# EAGLE design M81_1_0 (EAGLE 8.3.2)
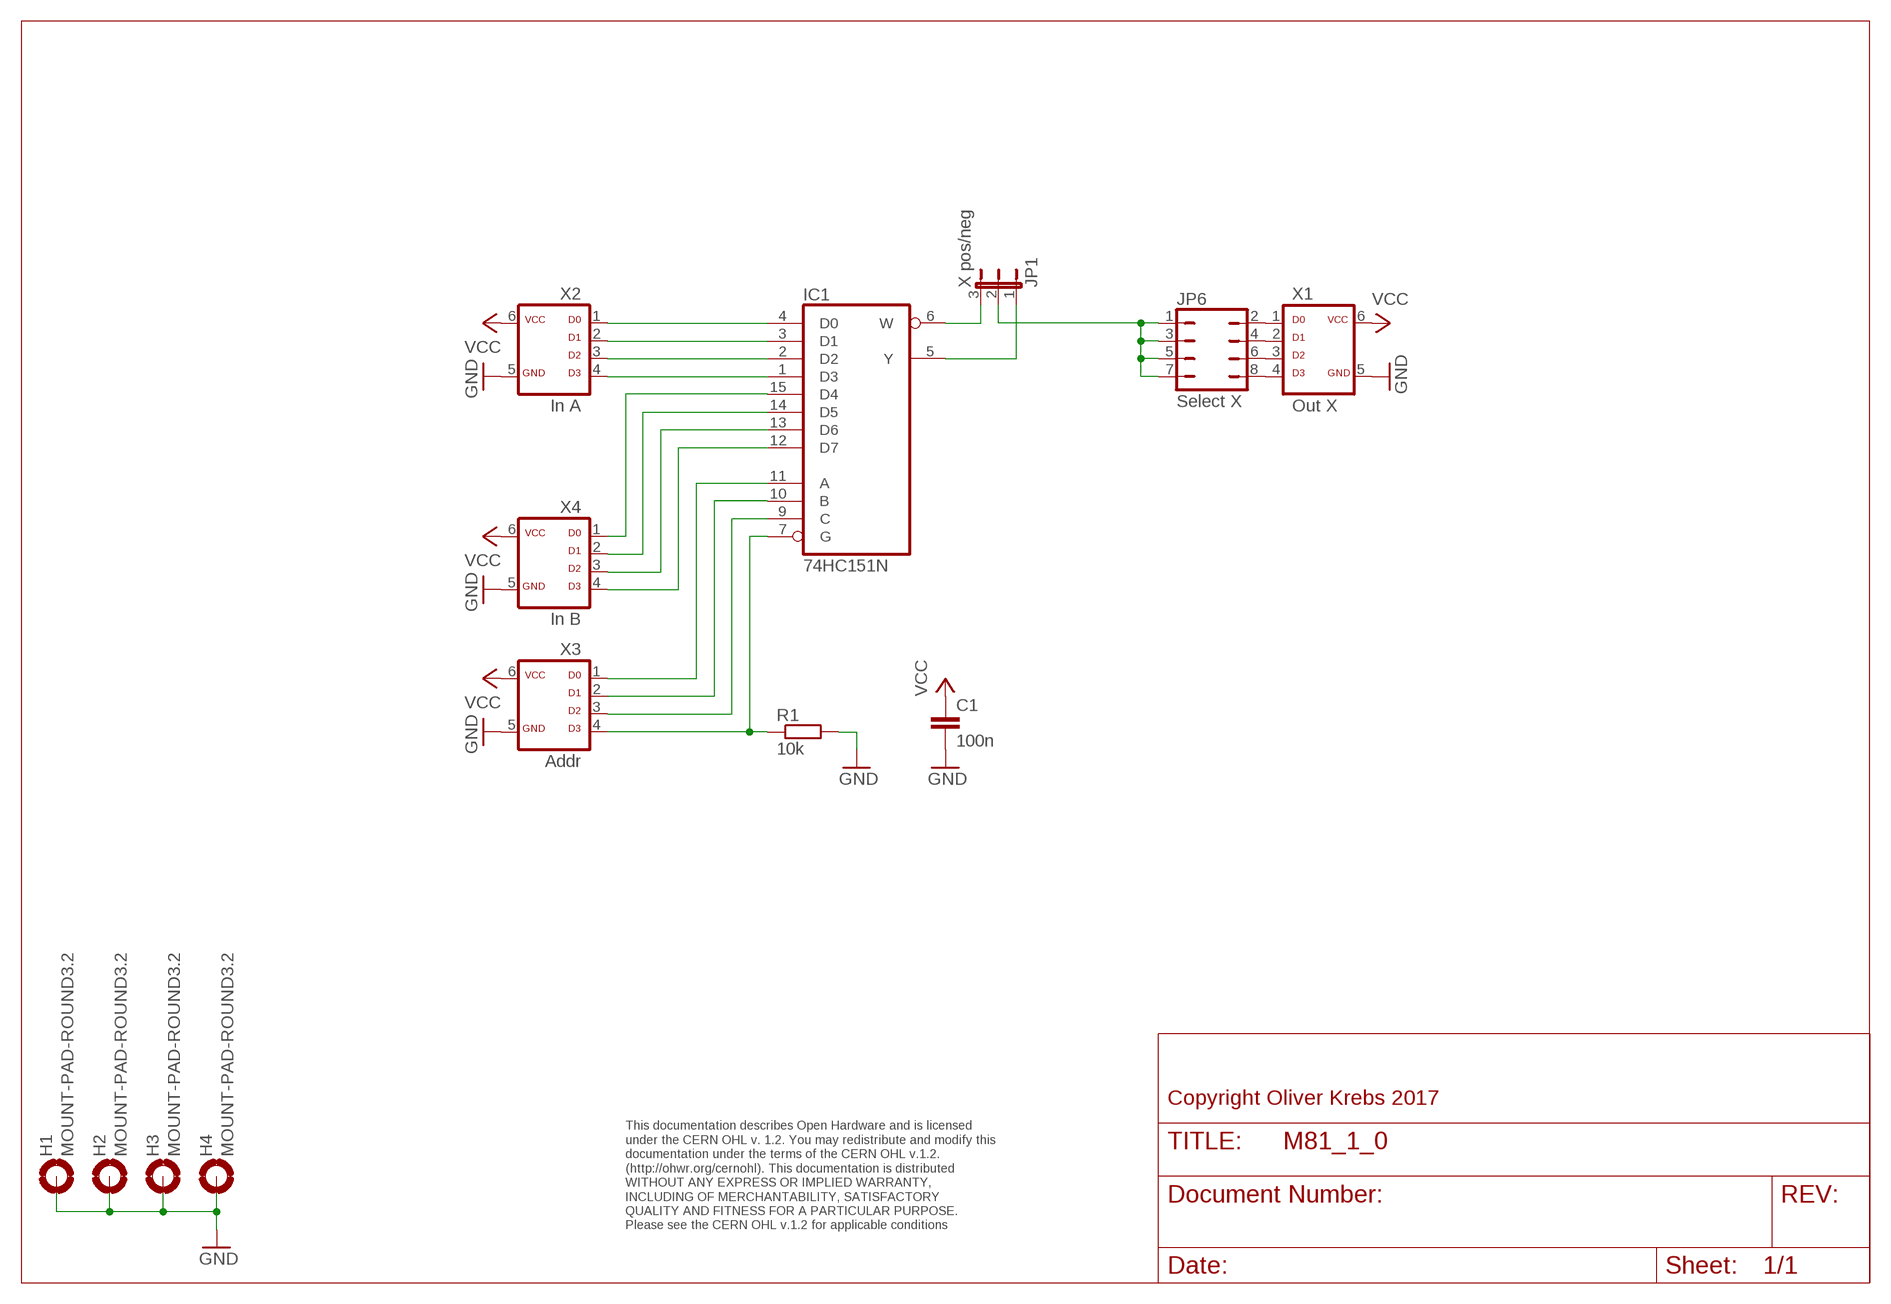
[diagram p0: schematic, sheet 1]

## Parts
C1  100n  C-EU050-025X075  [C050-025X075]
H1  MOUNT-PAD-ROUND3.2  [3,2-PAD]
H2  MOUNT-PAD-ROUND3.2  [3,2-PAD]
H3  MOUNT-PAD-ROUND3.2  [3,2-PAD]
H4  MOUNT-PAD-ROUND3.2  [3,2-PAD]
IC1  74HC151N  [DIL16]
JP1  X pos/neg  JP2E  [JP2]
JP6  Select X  JP4Q  [JP4Q]
R1  10k  R-EU_0207/10  [0207/10]
X1  Out X  ML6D  [ML-6]
X2  In A  ML6D  [ML-6]
X3  Addr  ML6D  [ML-6]
X4  In B  ML6D  [ML-6]

## Nets
GND: C1.2 H1.B3,2(MOUNT) H2.B3,2(MOUNT) H3.B3,2(MOUNT) H4.B3,2(MOUNT) R1.2 X1.5 X2.5 X3.5 X4.5
N$1: IC1.5(Y) JP1.1
N$2: IC1.6(W) JP1.3
N$3: JP1.2 JP6.1 JP6.3 JP6.5 JP6.7
N$4: IC1.4(D0) X2.1
N$5: IC1.3(D1) X2.2
N$6: IC1.2(D2) X2.3
N$7: IC1.1(D3) X2.4
N$8: IC1.15(D4) X4.1
N$9: IC1.14(D5) X4.2
N$10: IC1.13(D6) X4.3
N$11: IC1.12(D7) X4.4
N$12: IC1.11(A) X3.1
N$13: IC1.10(B) X3.2
N$14: IC1.9(C) X3.3
N$15: IC1.7(G) R1.1 X3.4
N$18: JP6.2 X1.1
N$19: JP6.4 X1.2
N$20: JP6.6 X1.3
N$21: JP6.8 X1.4
VCC: C1.1 X1.6 X2.6 X3.6 X4.6

## Notes on the sheet
- Copyright Oliver Krebs 2017
- This documentation describes Open Hardware and is licensed 
  under the CERN OHL v. 1.2. You may redistribute and modify this 
  documentation under the terms of the CERN OHL v.1.2. 
  (http://ohwr.org/cernohl). This documentation is distributed
  WITHOUT ANY EXPRESS OR IMPLIED WARRANTY, 
  INCLUDING OF MERCHANTABILITY, SATISFACTORY 
  QUALITY AND FITNESS FOR A PARTICULAR PURPOSE. 
  Please see the CERN OHL v.1.2 for applicable conditions

## Power pins joined to a net without a drawn wire
GND: IC1.8(GND)
VCC: IC1.16(VCC)

## Library data of the parts
C1 = 01-my_rcl:C-EU: CAPACITOR, European symbol
H1-H4 = holes:MOUNT-PAD-ROUND: MOUNTING PAD, round
IC1 = 74xx-eu:74*151: Data SELECTOR/MULTIPLEXER
JP1 = jumper:JP2E: JUMPER
JP6 = 01-my-jumper:JP4Q: JUMPER
R1 = 01-my_rcl:R-EU_: RESISTOR, European symbol
X1-X4 = 01-my-con:ML6D

## Board
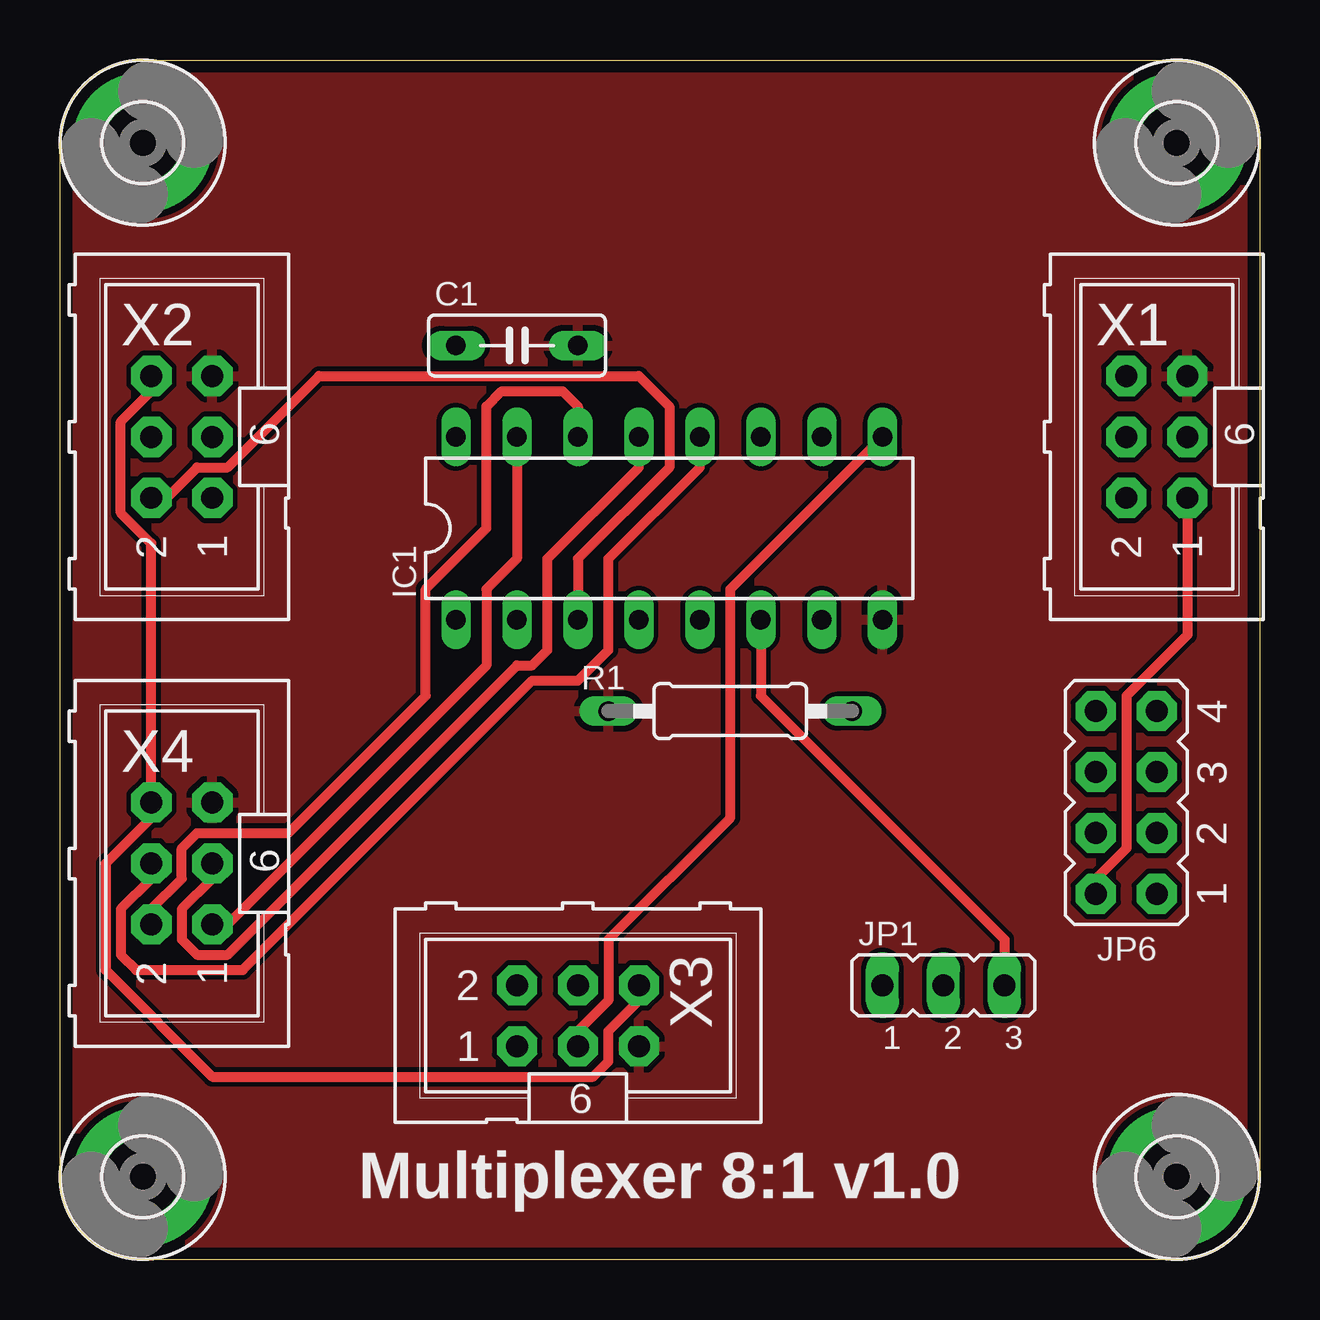
[diagram p1: board, top side]
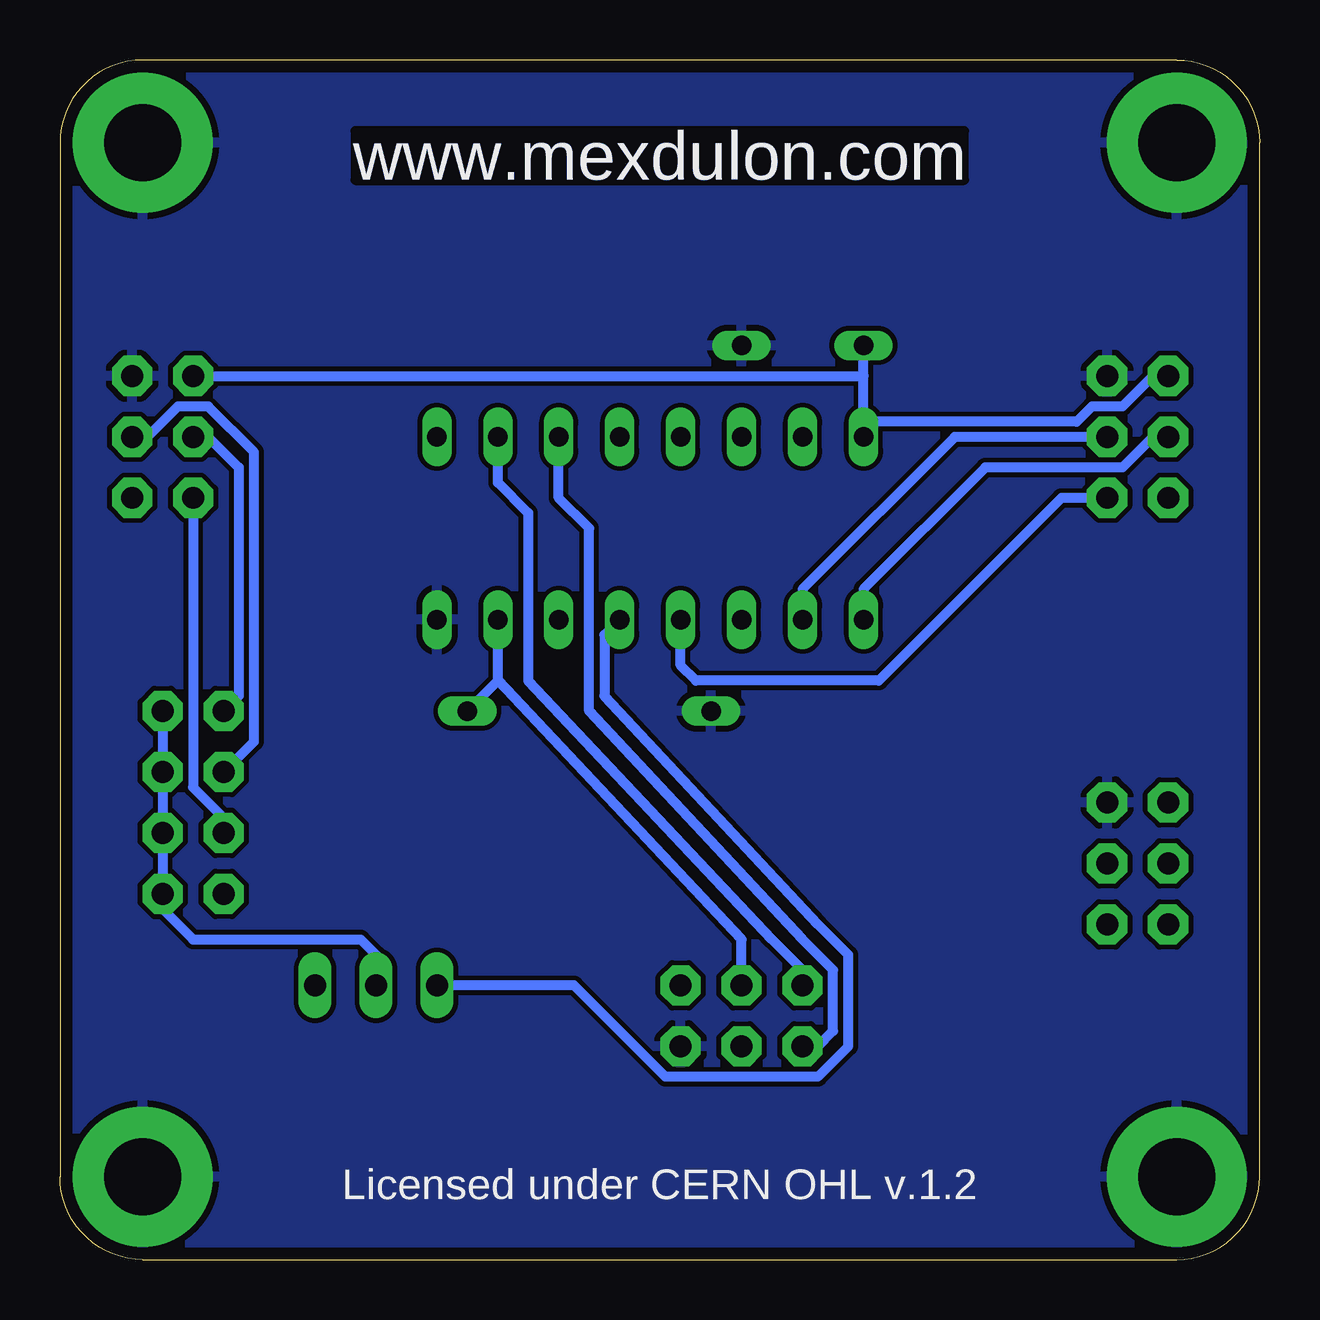
[diagram p2: board, bottom side, seen from below]

Size 50 x 50 mm. Coordinates in mm from the lower left corner, seen from the top.
Outline: 0,3.45 0,46.55 arc-90 3.45,50 46.55,50 arc-90 50,46.55 50,3.45 arc-90 46.55,0 3.45,0 arc-90 0,3.45
Copper layers (1*16): Top 0.035mm / dielectric 1.6mm / Bottom 0.035mm
Design rules "Elecrow_2-layer_PCB_eagle_rule": minimum track width 6mil, minimum drill 12mil, track to track 6mil, track to pad 6mil, pad to pad 6mil, via to via 8mil, smd to smd 0mil, copper to edge 20mil, drill to drill 10mil, minimum pad ring 6mil, minimum via ring 6mil, stop-mask expansion 0mil, vias tented up to drill 100mil, thermal gap 10mil

### Footprints (pad centres in the part's own frame; a part is rotated, then mirrored left to right if it is on the bottom)
C050-025X075 = drill 0.813 long: 1 -2.54,0; 2 2.54,0
3,2-PAD = drill 3.2 pad 5.842: B3,2 0,0
DIL16 = drill 0.813 long: 1 -8.89,-3.81; 2 -6.35,-3.81; 3 -3.81,-3.81; 4 -1.27,-3.81; 5 1.27,-3.81; 6 3.81,-3.81; 7 6.35,-3.81; 8 8.89,-3.81; 9 8.89,3.81; 10 6.35,3.81; 11 3.81,3.81; 12 1.27,3.81; 13 -1.27,3.81; 14 -3.81,3.81; 15 -6.35,3.81; 16 -8.89,3.81
JP2 = drill 0.914 long: 1 -2.54,0; 2 0,0; 3 2.54,0
JP4Q = drill 0.914 pad 1.676 octagon: 1 -3.81,-1.27; 2 -3.81,1.27; 3 -1.27,-1.27; 4 -1.27,1.27; 5 1.27,-1.27; 6 1.27,1.27; 7 3.81,-1.27; 8 3.81,1.27
0207/10 = drill 0.813 long: 1 -5.08,0; 2 5.08,0
ML-6 = drill 0.914 pad 1.676 octagon: 1 -2.54,-1.27; 2 -2.54,1.27; 3 0,-1.27; 4 0,1.27; 5 2.54,-1.27; 6 2.54,1.27

### Placement (x,y rotation side)
C1  19.05,38.1 0 top
H1  3.45,3.45 0 top
H2  3.45,46.55 0 top
H3  46.55,46.55 0 top
H4  46.55,3.45 0 top
IC1  25.4,30.48 0 top
JP1  36.83,11.43 0 top
JP6  44.45,19.05 90 top
R1  27.94,22.86 180 top
X1  45.72,34.29 90 top
X2  5.08,34.29 90 top
X3  21.59,10.16 0 top
X4  5.08,16.51 90 top

### Tracks (layer width: path | path; a pad name or v marks a point on that pad's centre or on a via)
GND
  pour Bottom (isolate 0.203): 0,50.16 50.8,50.16 50.8,0 0,0
  pour Top (isolate 0.203): 0,50.16 50.8,50.16 50.8,0 0,0
N$1
  Bottom 0.406: JP1.1 28.57,11.43 24.77,7.62 18.41,7.62 17.14,8.89 17.14,12.7 18.41,13.97 27.3,23.5 27.3,26.04 IC1.5
N$2
  Top 0.406: IC1.6 29.21,23.5 39.37,13.34 JP1.3
N$3
  Bottom 0.406: JP6.7 JP6.5 JP6.3 JP6.1 45.72,14.61 44.45,13.34 37.47,13.34 36.83,12.7 JP1.2
N$4
  Bottom 0.406: X2.1 8.26,31.75 15.88,24.13 23.5,24.13 24.13,24.77 IC1.4
N$5
  Top 0.406: X2.2 4.45,31.75 5.71,33.02 6.99,33.02 10.79,36.83 24.13,36.83 25.4,35.56 25.4,33.02 21.59,29.21 IC1.3
N$6
  Bottom 0.406: IC1.2 19.05,27.94 12.7,34.29 X2.3
N$7
  Bottom 0.406: X2.4 4.45,34.29 5.71,33.02 11.43,33.02 16.51,27.94 IC1.1
N$8
  Top 0.406: IC1.15 19.05,29.21 17.78,27.94 17.78,24.77 6.99,13.97 X4.1
N$9
  Top 0.406: X4.2 3.81,14.61 5.08,15.88 5.08,17.14 5.71,17.78 9.53,17.78 15.24,23.5 15.24,27.94 17.78,30.48 17.78,35.56 18.41,36.2 20.95,36.2 21.59,35.56 IC1.14
N$10
  Top 0.406: X4.3 6.35,15.88 5.08,14.61 5.08,13.34 5.71,12.7 6.99,12.7 19.05,24.77 19.68,24.77 20.32,25.4 20.32,29.21 24.13,33.02 IC1.13
N$11
  Top 0.406: X4.4 3.81,15.88 2.54,14.61 2.54,12.7 3.17,12.06 7.62,12.06 19.68,24.13 21.59,24.13 22.86,25.4 22.86,29.21 26.67,33.02 IC1.12
N$12
  Bottom 0.406: X3.1 18.41,8.89 17.78,9.53 17.78,12.06 19.05,13.34 27.94,22.86 27.94,30.48 29.21,31.75 IC1.11
N$13
  Bottom 0.406: IC1.10 31.75,32.38 30.48,31.11 30.48,24.13 20.32,13.34 19.05,12.06 X3.2
N$14
  Top 0.406: X3.3 21.59,9.53 22.86,10.79 22.86,13.34 27.94,18.41 27.94,27.94 IC1.9
N$15
  Bottom 0.406: 31.75,24.13 IC1.7 | 31.75,24.13 R1.1 | X3.4 21.59,13.34 31.75,24.13
N$18
  Top 0.406: X1.1 46.99,26.04 44.45,23.5 44.45,17.14 43.18,15.88 JP6.2
N$19
  Bottom 0.406: X1.2 44.45,19.68 43.18,18.41 JP6.4
N$20
  Bottom 0.406: JP6.6 41.91,21.59 41.91,33.66 43.81,35.56 45.09,35.56 46.35,34.29 X1.3
N$21
  Bottom 0.406: X1.4 43.81,34.29 42.55,33.02 42.55,23.5 JP6.8
VCC
  Top 0.406: X2.6 3.81,36.2 2.54,34.92 2.54,31.11 3.81,29.84 X4.6 3.81,18.41 1.91,16.51 1.91,12.06 6.35,7.62 22.23,7.62 22.86,8.26 22.86,9.53 24.13,10.79 X3.6
  Bottom 0.406: X2.6 4.45,36.83 5.71,35.56 6.99,35.56 7.62,34.92 16.51,34.92 | 16.51,36.83 C1.1 | 16.51,34.92 16.51,36.83 | 16.51,34.92 IC1.16 | X1.6 16.51,36.83

### Text on the board
Bottom: www.mexdulon.com
tNames: Multiplexer 8:1 v1.0
bNames: www.mexdulon.com | Licensed under CERN OHL v.1.2
200bmp: E:/Bilder/Elektronik/Modulion/Mexdulon/mexdulon_50x50_pcb.bmp